# EAGLE design Singularitron SD Card Module (EAGLE 7.3.0)
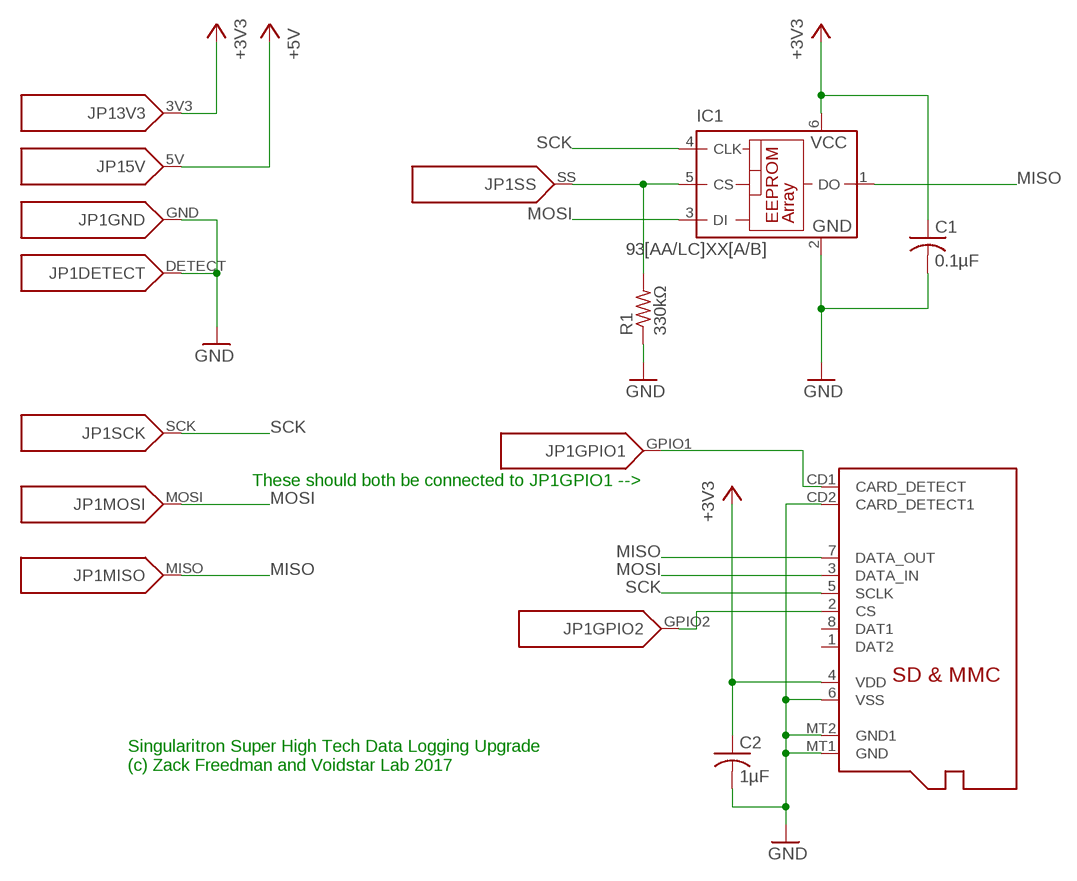
[diagram p0: schematic, sheet 1]

## Parts
C1  0.1µF  C-USC0603  [C0603]
C2  1µF  C-USC0603  [C0603]
IC1  93[AA/LC]XX[A/B]  93AA76A  [SOT23-6]
JP1  SINGULARITRON_CART_BASE  [SINGULARITRON_CART_BASE]
JP2  MICROSD  [MICROSD]
R1  330kΩ  R-US_R0603  [R0603]

## Nets
+3V3: C1.1 C2.1 IC1.6(VCC) JP1.3V3 JP2.4(VDD)
+5V: JP1.5V
GND: C1.2 C2.2 IC1.2(GND) JP1.DETECT JP1.GND JP2.6(VSS) JP2.CD2(CARD_DETECT1) JP2.MT1(GND) JP2.MT2(GND1) R1.1
MISO: IC1.1(DO) JP1.MISO JP2.7(DATA_OUT)
MOSI: IC1.3(DI) JP1.MOSI JP2.3(DATA_IN)
N$1: IC1.5(CS) JP1.SS R1.2
N$2: JP1.GPIO1 JP2.CD1(CARD_DETECT)
N$3: JP1.GPIO2 JP2.2(CS)
SCK: IC1.4(CLK) JP1.SCK JP2.5(SCLK)
Unconnected: JP1.SCL JP1.SDA JP2.1(DAT2) JP2.8(DAT1)

## Notes on the sheet
- These should both be connected to JP1GPIO1 -->
- Singularitron Super High Tech Data Logging Upgrade
  (c) Zack Freedman and Voidstar Lab 2017

## Library data of the parts
C1 C2 = rcl:C-US: CAPACITOR, American symbol
IC1 = microchip:93*76?: 8K Microwire Compatible Serial EEPROM Source: http://ww1.microchip.com/downloads/en/DeviceDoc/21796H.pdf; MPN: 93AA76AT-I/OT; OC_FARNELL: 1331443; OC_NEWARK: 35M2481
JP1 = Voidstar-Exotic:SINGULARITRON_CART_BASE
JP2 = adafruit:MICROSD: Micro-SD / Transflash card holder with SPI pinout For the 3M # 2908-05WB-MG and/or 4UCON #19656 push-push type
R1 = rcl:R-US_: RESISTOR, American symbol

## Board
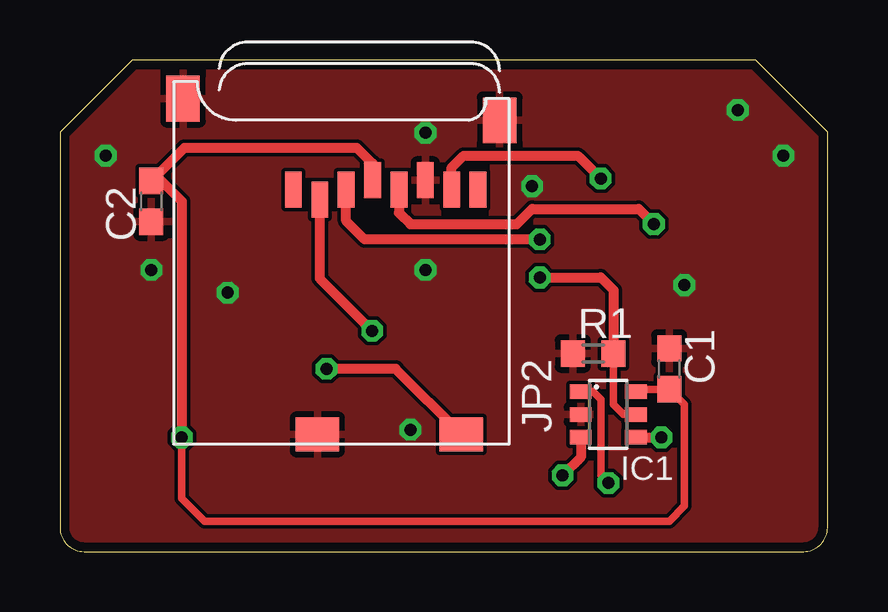
[diagram p1: board, top side]
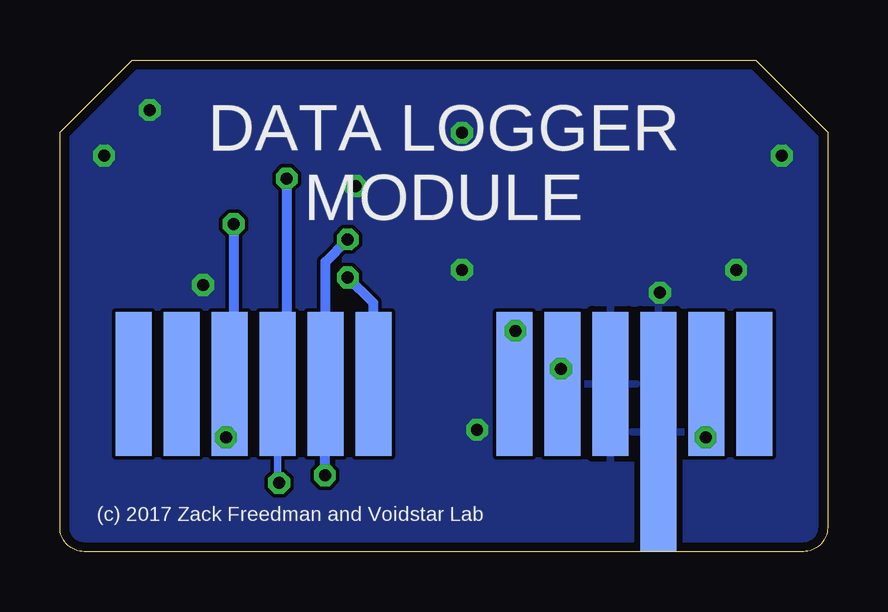
[diagram p2: board, bottom side, seen from below]

Size 32 x 20.5 mm. Coordinates in mm from the lower left corner, seen from the top.
Outline: 29,20.5 3,20.5 0,17.5 0,1 arc90 1,0 31,0 arc90 32,1 32,17.5 29,20.5
Copper layers (1*16): Top 0.035559375mm / dielectric 1.501140625mm / Bottom 0.035559375mm
Design rules "typical_4pcb *": minimum track width 10mil, minimum drill 15mil, track to track 6mil, track to pad 6mil, pad to pad 6mil, via to via 6mil, smd to smd 6mil, copper to edge 15mil, drill to drill 8mil, minimum pad ring 10mil, minimum via ring 8mil, stop-mask expansion 4mil, vias tented up to drill 20mil, thermal gap 10mil

### Footprints (pad centres in the part's own frame; a part is rotated, then mirrored left to right if it is on the bottom)
C0603 = smd 1.1 x 1: 1 -0.85,0; 2 0.85,0
SOT23-6 = smd 0.6 x 0.9: 1 -0.95,-1.15; 2 0,-1.15; 3 0.95,-1.15; 4 0.95,1.15; 5 0,1.15; 6 -0.95,1.15
SINGULARITRON_CART_BASE = smd 1.5 x 6 bottom: 3V3 5.062,7; 5V 3.062,7; DETECT 9.062,7; GPIO1 11.062,7; GPIO2 13.062,7; MISO 22.938,7; MOSI 20.938,7; SCK 24.938,7; SCL 28.938,7; SDA 26.938,7; SS 18.938,7 | smd 1.5 x 10 bottom: GND 7.062,5
MICROSD = smd 0.7 x 1.5: 1 9,-10.64; 2 7.9,-10.24; 3 6.8,-10.64; 4 5.7,-11.04; 5 4.6,-10.64; 6 3.5,-11.04; 7 2.4,-10.64; 8 1.3,-10.64 | smd 1.8 x 1.4: CD1 2,-0.44; CD2 8,-0.44 | smd 1.4 x 1.9: MT1 0.4,-13.54; MT2 13.6,-14.44
R0603 = smd 1 x 1.1: 1 -0.85,0; 2 0.85,0

### Placement (x,y rotation side)
C1  25.4,7.62 90 top
C2  3.81,14.61 270 top
IC1  22.86,5.71 270 top
JP1  0,0 0 top
JP2  18.73,4.45 180 top
R1  22.23,8.26 0 top

### Tracks (layer width: path | path; a pad name or v marks a point on that pad's centre or on a via)
+3V3  (via drill 0.5)
  Top 0.305: IC1.6 24.11,6.77 C1.1 26.04,6.13 26.04,1.91 25.4,1.27 6.03,1.27 5.08,2.22 v5.08,4.76
  Top 0.406: JP2.4 13.03,16.18 12.38,16.83 5.18,16.83 C2.1 4.23,15.46 5.08,14.61 v5.08,4.76
  Bottom 0.305: JP1.3V3 5.08,6.98 v5.08,4.76
GND  (via drill 0.5)
  other vias: 6.99,10.79 26.04,11.11 28.26,18.41 30.16,16.51 1.91,16.51 15.24,17.46 15.24,11.75 19.68,15.24 3.81,11.75 14.61,5.08
  pour Top: 0,0 0,21.27 33.02,21.27 33.02,0
  pour Bottom: 0,0 0,21.27 33.02,21.27 33.02,0
MISO  (via drill 0.5)
  Top 0.305: IC1.1 22.23,6.67 22.54,6.35 22.54,3.17 v22.86,2.86
  Top 0.406: JP2.7 16.33,16.02 16.83,16.51 21.59,16.51 v22.54,15.56
  Bottom 0.305: v22.86,2.86 22.94,2.94 JP1.MISO
  Bottom 0.406: v22.54,15.56 22.54,7.39 JP1.MISO
MOSI  (via drill 0.5)
  Top 0.406: IC1.3 21.71,3.93 v20.95,3.17 | v20,13.02 12.7,13.02 11.93,13.79 JP2.3
  Bottom 0.406: v20.95,3.17 20.95,6.98 JP1.MOSI 20.94,12.08 v20,13.02
N$1  (via drill 0.5)
  Top 0.305: IC1.5 23.5,5.71 23.07,6.13 R1.2
  Top 0.406: v20,11.43 22.54,11.43 23.07,10.9 R1.2
  Bottom 0.406: JP1.SS 18.94,10.37 v20,11.43
N$2  (via drill 0.5)
  Top 0.406: JP2.CD1 14,7.62 v11.11,7.62
  Bottom 0.406: v11.11,7.62 11.06,7.57 JP1.GPIO1
N$3  (via drill 0.5)
  Top 0.406: JP2.2 10.83,11.39 v13.02,9.21
  Bottom 0.406: v13.02,9.21 13.02,7.04 JP1.GPIO2
SCK  (via drill 0.5)
  Top 0.406: IC1.4 v25.08,4.76 | JP2.5 14.13,14.12 14.61,13.65 19.05,13.65 19.68,14.29 24.13,14.29 v24.77,13.65
  Bottom 0.406: v25.08,4.76 25.08,6.35 | 25.08,6.35 25.08,6.86 JP1.SCK | v24.77,13.65 24.77,6.67 25.08,6.35

### Text on the board
bPlace: DATA LOGGER / MODULE | (c) 2017 Zack Freedman and Voidstar Lab